# Altium schematic sheet FTDI.SchDoc
size Legal; Author: Mark & Qiming; DocumentNumber: 5; SheetNumber: 5; SheetTotal: 9
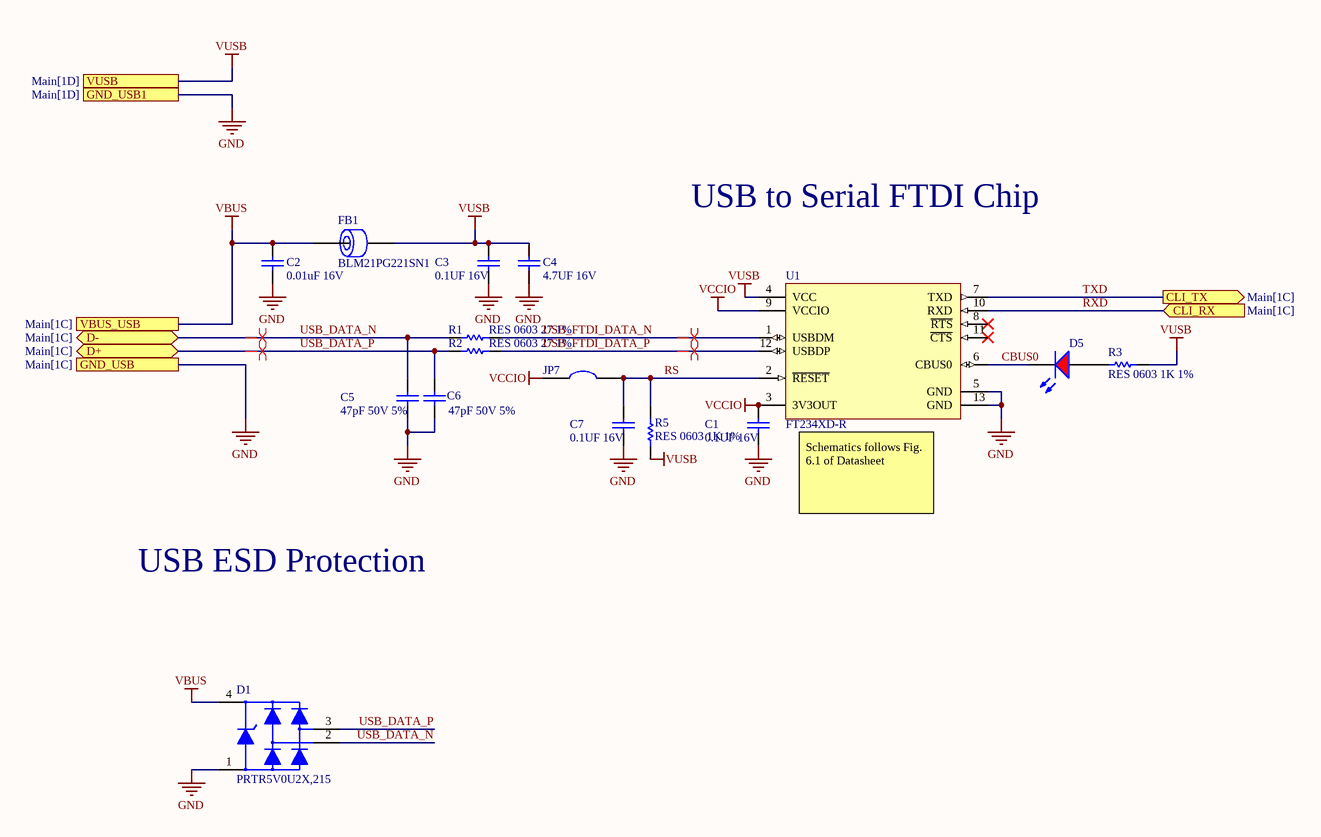
[diagram p0: FTDI.SchDoc]

## Parts
C1  0.1UF 16V  [0603_CAP]
C2  0.01uF 16V  [0603_CAP]
C3  0.1UF 16V  [0603_CAP]
C4  4.7UF 16V  [0805_CAP]
C5  47pF 50V 5%  [0603_CAP]
C6  47pF 50V 5%  [0603_CAP]
C7  0.1UF 16V  [0603_CAP]
D1  PRTR5V0U2X,215  [FP-SOT143B-NXP]
D5  LSM0805412V  [LED_0805_RED]  (value not drawn)
FB1  BLM21PG221SN1  [0805]
JP7  0603 link  [0603_JP_RES]  (value not drawn)  (net tie, no BOM)
R1  RES 0603 27 1%  [0603_RES]
R2  RES 0603 27 1%  [0603_RES]
R3  RES 0603 1K 1%  [0603_RES]
R5  RES 0603 1K 1%  [0603_RES]
U1  FT234XD-R  [FP-DFN-12-MFG]

## Ports
CLI_RX (in, see Main[1C]), CLI_TX (out, see Main[1C]), D+ (bidir, see Main[1C]), D- (bidir, see Main[1C]), GND_USB1 (see Main[1D]), GND_USB (see Main[1C]), VBUS_USB (see Main[1C]), VUSB (see Main[1D])

## Nets
GND: C1.1 C2.1 C3.1 C4.1 C5.1 C6.1 C7.1 D1.1 U1.5(GND) U1.13(GND) ; port GND_USB1, port GND_USB
VBUS: C2.2 D1.4 FB1.1 ; port VBUS_USB
VCCIO: C1.2 JP7.1 U1.3(3V3OUT) U1.9(VCCIO)
VUSB: C3.2 C4.2 FB1.2 R3.1 R5.1 U1.4(VCC) ; port VUSB
CBUS0: D5.K U1.6(CBUS0)
RS: C7.2 JP7.2 R5.2 U1.2(~{RESET})
RXD: U1.10(RXD) ; port CLI_RX
TXD: U1.7(TXD) ; port CLI_TX
USB_DATA_N: C5.2 D1.2 R1.1 ; port D-
USB_DATA_P: C6.2 D1.3 R2.1 ; port D+
USB_FTDI_DATA_N: R1.2 U1.1(USBDM)
USB_FTDI_DATA_P: R2.2 U1.12(USBDP)
NetD5_A: D5.A R3.2

Not connected (* = marked no-connect by the designer): U1 8(~{RTS})* 11(~{CTS})*

## Layout directives
differential pair; differential pair class USB; net class USB: USB_DATA_N, USB_DATA_P, USB_FTDI_DATA_N, USB_FTDI_DATA_P

## Notes on the sheet
- USB to Serial FTDI Chip
- Schematics follows Fig. 6.1 of Datasheet
- USB ESD Protection
- Title:
- Desc:
- Size:
- Letter
- Auth:
- Proj:
- Sheet
- of
- www.seas.upenn.edu
- Electrical and Systems Engineering

## Library data of the parts
C1 C3 C7 = CMP-011-000221-1: Capacitor Surface Mount 0603 Footprint 0.1UF 16V 10% Tolerance Ceramic X7R; Manufacturer P/N: CAP 0603 0.1UF 16V 10% X7R; Manufacturer: Various; Description in Visual: Cap SMT 0603 0.1UF 16V 10%  Cer X7R; PCB Package: 0603; Mount: SMT; Type: Ceramic X7R; Voltage: 16V; P/N: CAP 0603 0.1UF 16V 10% X7R; Value: 0.1UF; Tolerance: 10%
C2 = CMP-011-000185-1: Capacitor Surface Mount 0603 Footprint 0.01UF 16V 10% Tolerance Ceramic X7R; Manufacturer: Various; Manufacturer P/N: CAP 0603 0.01UF 16V 10% X7R; Description in Visual: Cap SMT 0603 0.01UF 16V 10%  Cer X7R; PCB Package: 0603; Type: Ceramic X7R; Value: 0.01UF; P/N: CAP 0603 0.01UF 16V 10% X7R; Voltage: 16V; Tolerance: 10%; Mount: SMT
C4 = CMP-011-000523-1: Capacitor Surface Mount 0805 Footprint 4.7UF 16V 10% Tolerance Ceramic X7R; Manufacturer P/N: CAP 0805 4.7UF 16V 10% X7R; Manufacturer: Various; PCB Package: 0805; Description in Visual: Cap SMT 0805 4.7UF 16V 10%  Cer X7R; Mount: SMT; P/N: CAP 0805 4.7UF 16V 10% X7R; Type: Ceramic X7R; Voltage: 16V; Tolerance: 10%; Value: 4.7UF
C5 C6 = CMP-011-000339-1: Capacitor Surface Mount 0603 Footprint 47PF 50V 5% Tolerance Ceramic C0G; Manufacturer P/N: CAP 0603 47PF 50V 5% C0G; Manufacturer: Various; Description in Visual: Cap SMT 0603 47PF 50V 5%  Cer C0G; PCB Package: 0603; Value: 47PF; Voltage: 50V; P/N: CAP 0603 47PF 50V 5% C0G; Mount: SMT; Tolerance: 5%; Type: Ceramic C0G
D1 = CMP-00371-1: Trans Voltage Suppressor Diode, 5.5V V(RWM), Unidirectional, 1 Element, Silicon; Min Breakdown Voltage: 6V; Number of Elements: 1; Time @ Peak Reflow Temperature-Max (s): 30s; Max Breakdown Voltage: 9V; Package Body Material: Plastic; Case Connection: ANODE; Surface Mount: Yes; Terminal Finish: Tin; Package Style: SMALL OUTLINEMeter; Moisture Sensitivity Level: 1; Reach SVHC Compliant: Yes; Terminal Position: DUAL; Pins: 4; Polarity: Unidirectional; Diode Type: TRANS VOLTAGE SUPPRESSOR; Package Shape: Rectangular; Terminal Form: Gull Wing; RoHS Compliant: Yes; JESD-609 Code: e3; Rep Pk Reverse Voltage-Max: 5.5V; Diode Element Material: SILICON; JESD-30 Code: R-PDSO-G4; Technology: AVALANCHE; Peak Reflow Temperature (Cel): 260°C
D5 = CMP-00026-00001-1: Single Color LED, RED, 0805; Test Current: 20mA; Forward Voltage: 2V; RoHS Compliant: Yes
FB1 = CMP-00229-4: Ferrite Chip 2000 mA 220 Ohms Differential Mode - Single 0805 Footprint; Manufacturer: Murata; Description in Visual: Ferrite SMT 2000mA 220Ohm Dif Mode 0805; Frequency: 100MHz; Usage: Power Supply; DC Resistance (ohms): 0.05; Impedance at Freq (ohms): 220Hz; Current (mA): 2000; ComponentLink3Description: Octopart Link; PCB Package: 0805; Operating Temperature Range: -55 to +125 °C; ComponentLink2URL: http://search.murata.co.jp/Ceramy/image/img/PDF/ENG/L0110S0100BLM21P.pdf; ComponentLink3URL: http://octopart.com/partsearch/#search/requestData&q=BLM21PG221SN1; ComponentLink1URL: http://www.murata.com; Manufacturer P/N: BLM21PG221SN1; ComponentLink2Description: Component Datasheet; ComponentLink1Description: Manufacturer Website; Filter type: Differential Mode - Single; P/N: BLM21PG221SN1
JP7 = CMP-00422-2: 0O link, SMD, 0603, Solder Bridge Option; Manufacturer P/N: Various; Manufacturer: Generic; Description in Visual: 0O link, Solder Bridge/SMD, Open; Value: 0.025; Source: Shunts and Jumpers.SchLib; Pin Count: 2; Design Item ID: 0603 link; Component Type: Net Tie; P/N: 0603 link
R1 R2 = CMP-005-002764-2: Resistor Surface Mount, 27 Ohms, 0603 Footprint, 1% Tolerance 0.1W; Manufacturer P/N: RES 0603 27R 1%; Manufacturer: Various; Description in Visual: Res SMT 27 0603  1%  0.1W; Value: 27; PCB Package: 0603; Mount: SMT; Tolerance: 1%; Power Rating: 0.1W
R3 R5 = CMP-005-002503-3: Resistor Surface Mount, 1K Ohms, 0603 Footprint, 1% Tolerance 0.1W; Manufacturer: Various; PCB Package: 0603; Description in Visual: Res SMT 1K 0603  1%  0.1W; Tolerance: 1%; Value: 1k; Mount: SMT; Power Rating: 0.1W; Manufacturer P/N: RES 0603 1K 1%; JLCPCB Part #: C21190
U1 = CMP-00104-3: USB Bridge, USB to UART USB 2.0 UART Interface 12-DFN (3x3); Nominal Supply Voltage: 5V; Qualification Status: Not Qualified; Package Body Material: Plastic; Time @ Peak Reflow Temperature-Max (s): 40s; Min Supply Voltage: 2.97V; Max Supply Voltage: 5.5V; Power Supplies: 1.8/3.3,3.3/5V; Package Style: SMALL OUTLINE, HEAT SINK/SLUG, THIN PROFILEMeter; Technology: CMOS; Terminal Pitch: 0.45mm; Terminal Position: DUAL; Moisture Sensitivity Level: 3; Reach SVHC Compliant: Yes; Length: 3mm; Package Shape: Square; Pins: 12; RoHS Compliant: Yes; Temperature Grade: INDUSTRIAL; Min Operating Temperature: -40°C; Peak Reflow Temperature (Cel): 260°C; Surface Mount: Yes; Terminal Form: No Lead; Max Operating Temperature: 85°C; Case/Package: HTSON; Width: 3mm